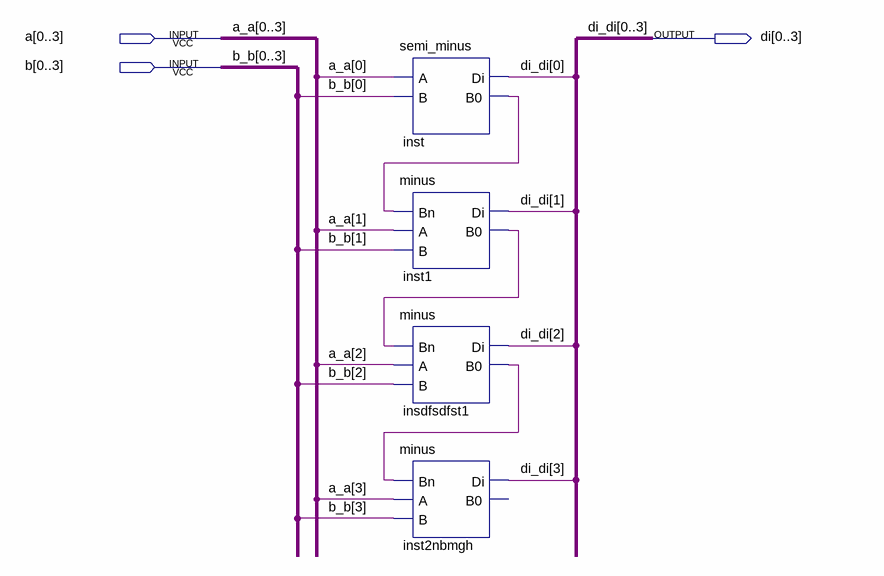
[diagram p0: schematic sheet]
// Quartus schematic minus_cascade.bdf as structural Verilog: 4 symbols, 3 pins
module minus_cascade (
  input  [0:3] a,
  input  [0:3] b,
  output [0:3] di
);

  wire insdfsdfst1_b0, inst1_b0, inst_b0;

  semi_minus inst (.A(a[0]), .B(b[0]), .Di(di[0]), .B0(inst_b0));
  minus inst1 (.Bn(inst_b0), .A(a[1]), .B(b[1]), .Di(di[1]), .B0(inst1_b0));
  minus insdfsdfst1 (.Bn(inst1_b0), .A(a[2]), .B(b[2]), .Di(di[2]), .B0(insdfsdfst1_b0));
  minus inst2nbmgh (.Bn(insdfsdfst1_b0), .A(a[3]), .B(b[3]), .Di(di[3]));  // open: B0

  // Other names for the same wires on the sheet: a_a[3:0] = {a[3], a[2], a[1], a[0]};
  //   b_b[3:0] = {b[3], b[2], b[1], b[0]}; di_di[3:0] = {di[3], di[2], di[1], di[0]}
endmodule
